# Altium schematic sheet 01-PCIe.SchDoc
size Tabloid; Customer: 01910; SheetNumber: 1; SheetTotal: 14
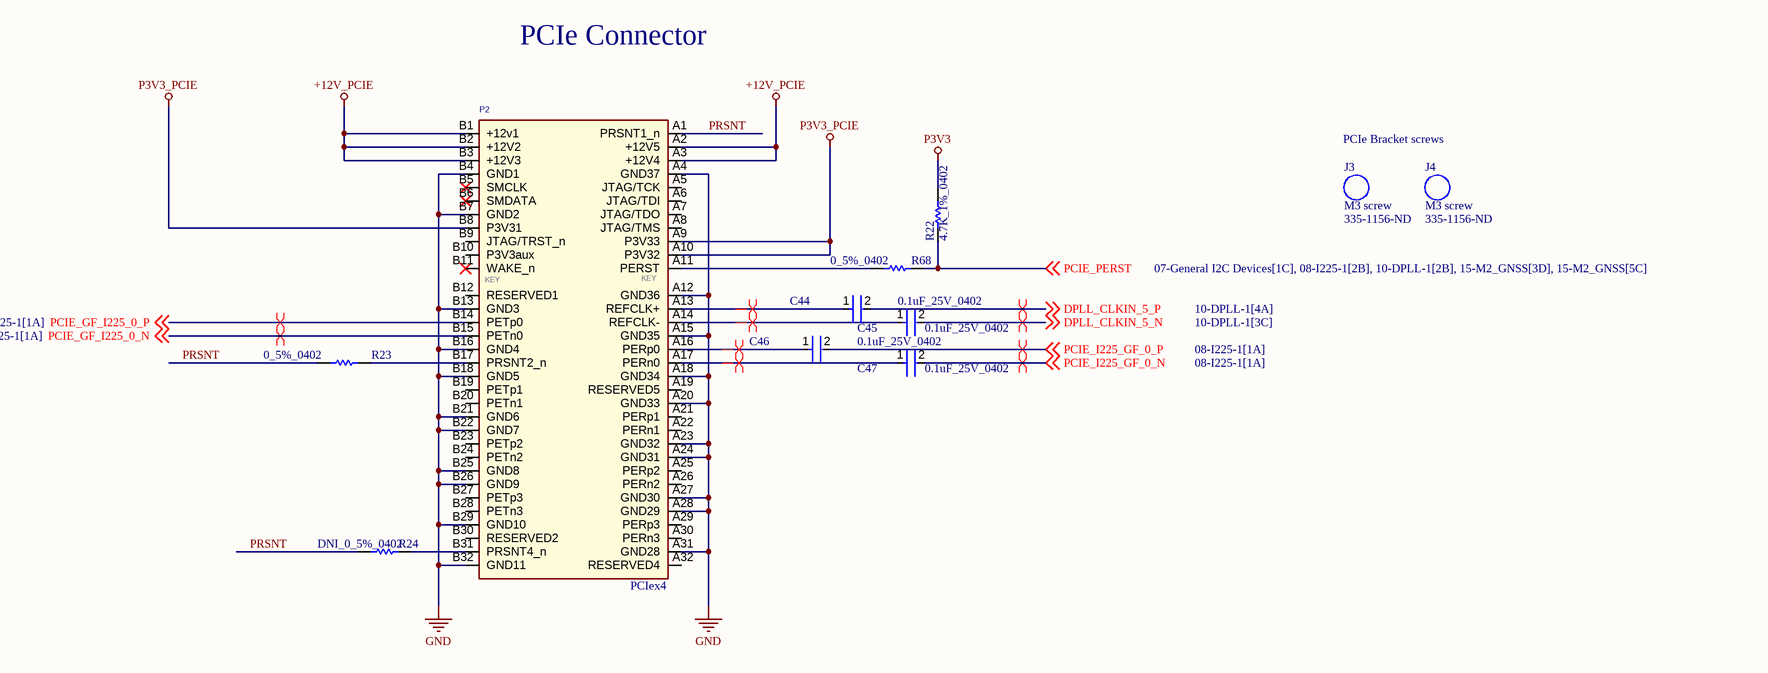
[diagram p0: 01-PCIe.SchDoc]

## Parts
C44  0.1uF_25V_0402  [FP-0402-L_1_0_1-W_0_5_0_1-IPC_C]
C45  0.1uF_25V_0402  [FP-0402-L_1_0_1-W_0_5_0_1-IPC_C]
C46  0.1uF_25V_0402  [FP-0402-L_1_0_1-W_0_5_0_1-IPC_C]
C47  0.1uF_25V_0402  [FP-0402-L_1_0_1-W_0_5_0_1-IPC_C]
J3  M3 screw  Supplier Part Number 1: 335-1156-ND
J4  M3 screw  Supplier Part Number 1: 335-1156-ND
P2  PCIex4  [PCIE_4LANE_EDGE]
R22  4.7K_1%_0402  [RESC1005X40X25NL10T10]
R23  0_5%_0402  [RESC1005X40X25LL10T10]
R24  DNI_0_5%_0402  [RESC1005X40X25LL10T10]  (no BOM)
R68  0_5%_0402  [RESC1005X40X25LL10T10]

## Nets
+12V_PCIE: P2.A2(+12V5) P2.A3(+12V4) P2.B1(+12v1) P2.B2(+12V2) P2.B3(+12V3)
GND: P2.A4(GND37) P2.A12(GND36) P2.A15(GND35) P2.A18(GND34) P2.A20(GND33) P2.A23(GND32) P2.A24(GND31) P2.A27(GND30) P2.A28(GND29) P2.A31(GND28) P2.B4(GND1) P2.B7(GND2) P2.B13(GND3) P2.B16(GND4) P2.B18(GND5) P2.B21(GND6) P2.B22(GND7) P2.B25(GND8) P2.B26(GND9) P2.B29(GND10) P2.B32(GND11)
P3V3: R22.2
P3V3_PCIE: P2.A9(P3V33) P2.A10(P3V32) P2.B8(P3V31)
DPLL_CLKIN_5_N: C45.2 ; off-sheet DPLL_CLKIN_5_N
DPLL_CLKIN_5_P: C44.2 ; off-sheet DPLL_CLKIN_5_P
PCIE_GF_I225_0_N: P2.B15(PETn0) ; off-sheet PCIE_GF_I225_0_N
PCIE_GF_I225_0_P: P2.B14(PETp0) ; off-sheet PCIE_GF_I225_0_P
PCIE_I225_GF_0_N: C47.2 ; off-sheet PCIE_I225_GF_0_N
PCIE_I225_GF_0_P: C46.2 ; off-sheet PCIE_I225_GF_0_P
PCIE_PERST: R22.1 R68.2 ; off-sheet PCIE_PERST
PRSNT: P2.A1(PRSNT1_n) R23.1 R24.1
NetC44_1: C44.1 P2.A13(REFCLK+)
NetC45_1: C45.1 P2.A14(REFCLK-)
NetC46_1: C46.1 P2.A16(PERp0)
NetC47_1: C47.1 P2.A17(PERn0)
NetP2_A11: P2.A11(PERST) R68.1
NetP2_B17: P2.B17(PRSNT2_n) R23.2
NetP2_B31: P2.B31(PRSNT4_n) R24.2

Not connected (* = marked no-connect by the designer): P2 A5(JTAG/TCK) A6(JTAG/TDI) A7(JTAG/TDO) A8(JTAG/TMS) A19(RESERVED5) A21(PERp1) A22(PERn1) A25(PERp2) A26(PERn2) A29(PERp3) A30(PERn3) A32(RESERVED4) B5(SMCLK)* B6(SMDATA)* B9(JTAG/TRST_n) B10(P3V3aux) B11(WAKE_n)* B12(RESERVED1) B19(PETp1) B20(PETn1) B23(PETp2) B24(PETn2) B27(PETp3) B28(PETn3) B30(RESERVED2)

## Layout directives
differential pair: DPLL_CLKIN_5_N, DPLL_CLKIN_5_P, NetC44_1, NetC45_1, NetC46_1, NetC47_1, PCIE_GF_I225_0_N, PCIE_GF_I225_0_P, PCIE_I225_GF_0_N, PCIE_I225_GF_0_P

## Notes on the sheet
- PCIe Connector
- PCIe Bracket screws
- SHEET
- REV
- timingcard.com <http://timingcard.com>
- DATE
- OF
- (in symbol PCIex4) KEY

## Library data of the parts
C44-C47 = CMP-2008-02519-2: General Purpose Ceramic Capacitor, 0402, 100nF, 10%, X7R, 15%, 25V; Package Quantity: 1; Capacitance: 100nF; Min Operating Temperature: -55°C; Voltage: 25V; Voltage Rating: 25V; Construction: Flat; Max Operating Temperature: 125°C; Radiation Hardening: No; Depth: 0.5mm; Thickness: 0.022inch; Voltage Rating (DC): 25V; Number of Pins: 2; Lead Free: Lead Free; Series: -; REACH SVHC: No SVHC; Length: 1mm; Dielectric: X7R; RoHS Compliant: Yes; Mount: Surface Mount; Packaging: Tape and Reel; Case/Package: 0402; Case Code (Imperial): 0402; Termination: SMD/SMT; Width: 0.02inch; Case Code (Metric): 1005; Tolerance: 10%
P2 = PCIex4: PCIE x4 Edge Connector,OrCAD Symbol,NC; Part Number: 451; Manufacturer: NA; NOTE: NC; Vendor P/N: NA; Part Type: SMT
R22 = CMP-2002-05217-1: Manufacturer: Bourns; Part Number: CR0402-FX-4701GLF
R23 R24 R68 = CMP-2002-04569-1: Manufacturer: KOA Speer; Part Number: RK73Z1ETTP
J3 J4 = M3 screw: Supplier 1: Digi-Key